# EAGLE design FMC_intan_RHD_interface (EAGLE 6.3)
DESIGNER: OPEN EPHYS; DESIGN_NAME: FMC ACQUISITION ADAPTER; REVISION: 0.1

## Sheet 1 of 2
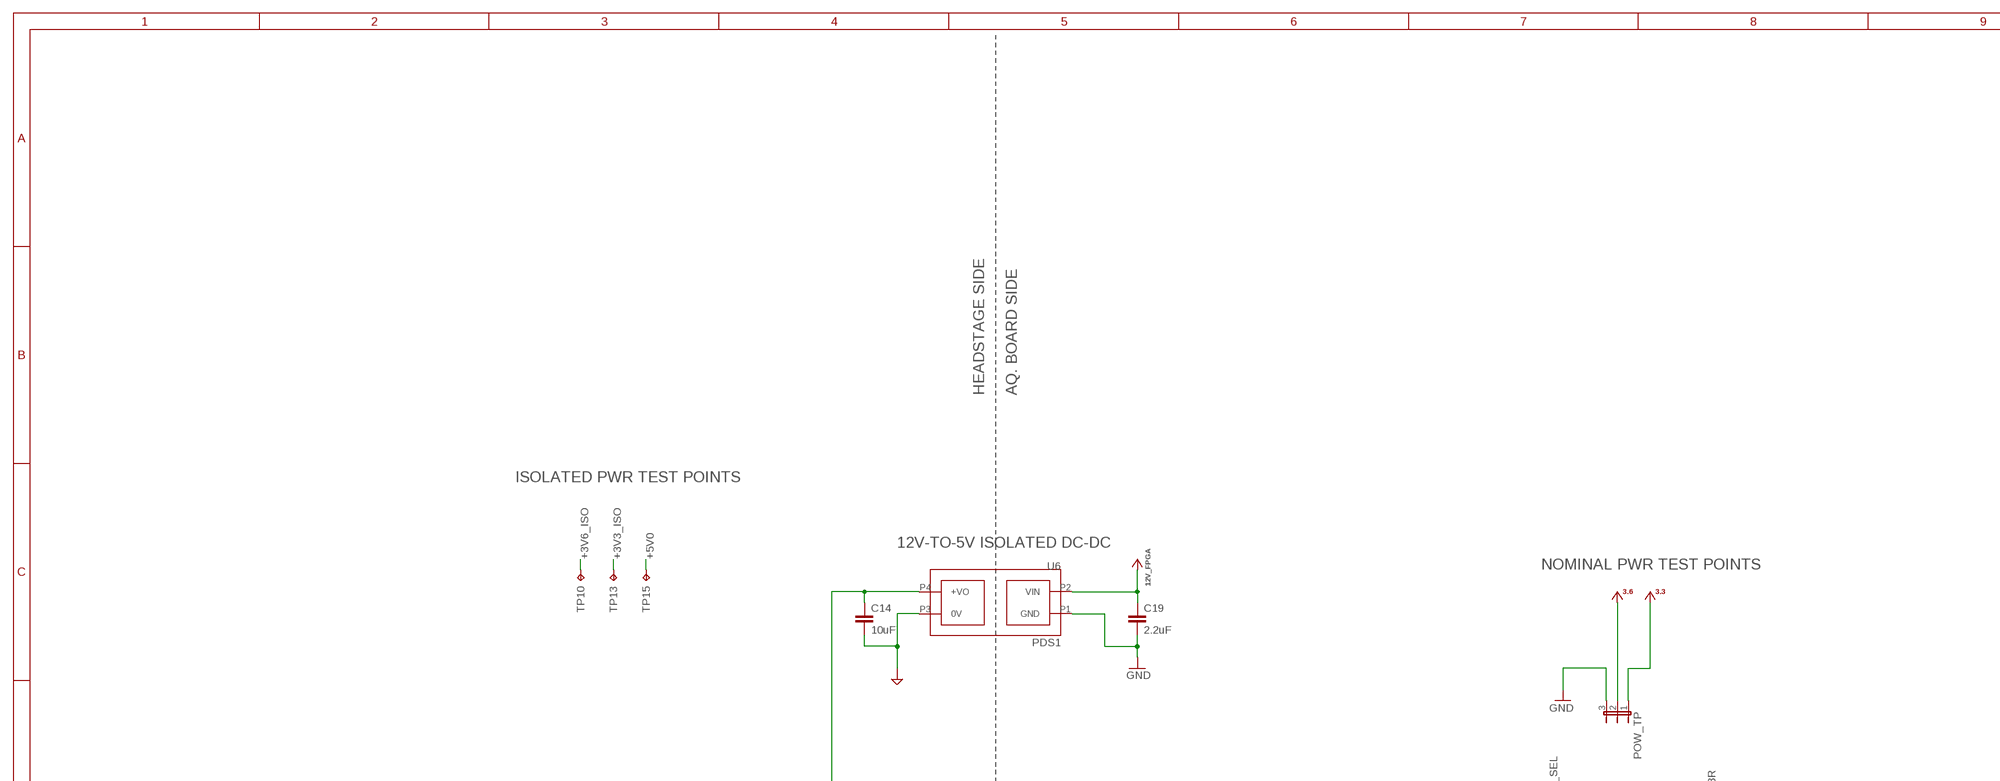
[diagram p0: schematic, sheet 1, part 1 of 3]
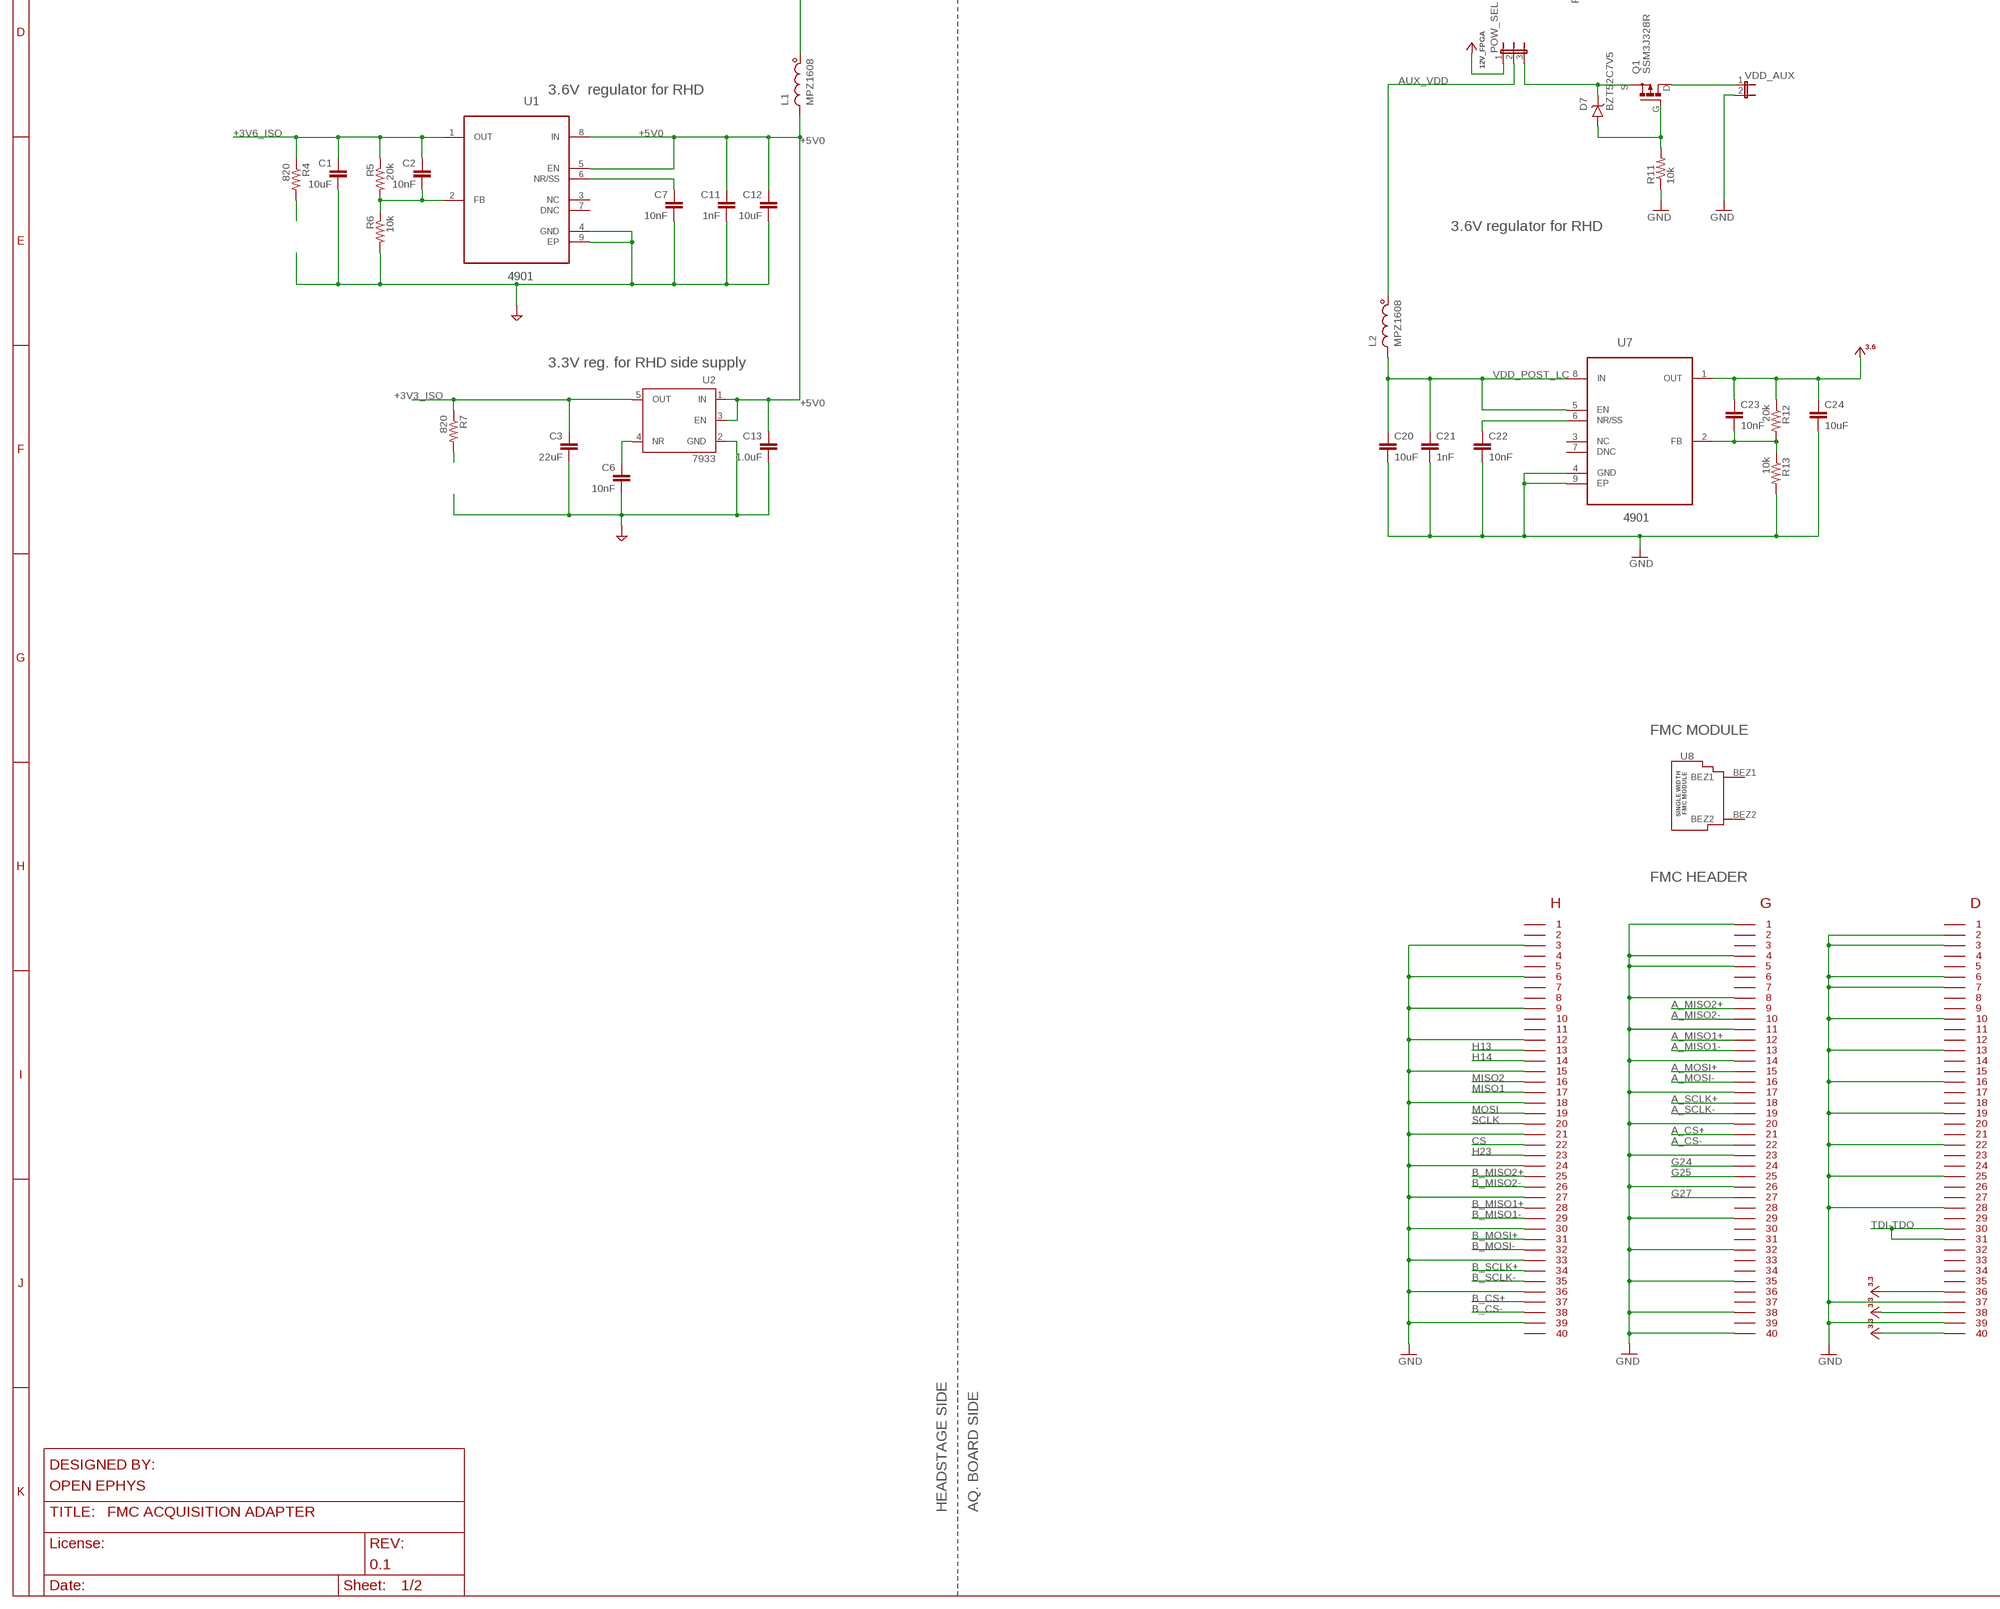
[diagram p1: schematic, sheet 1, part 2 of 3]
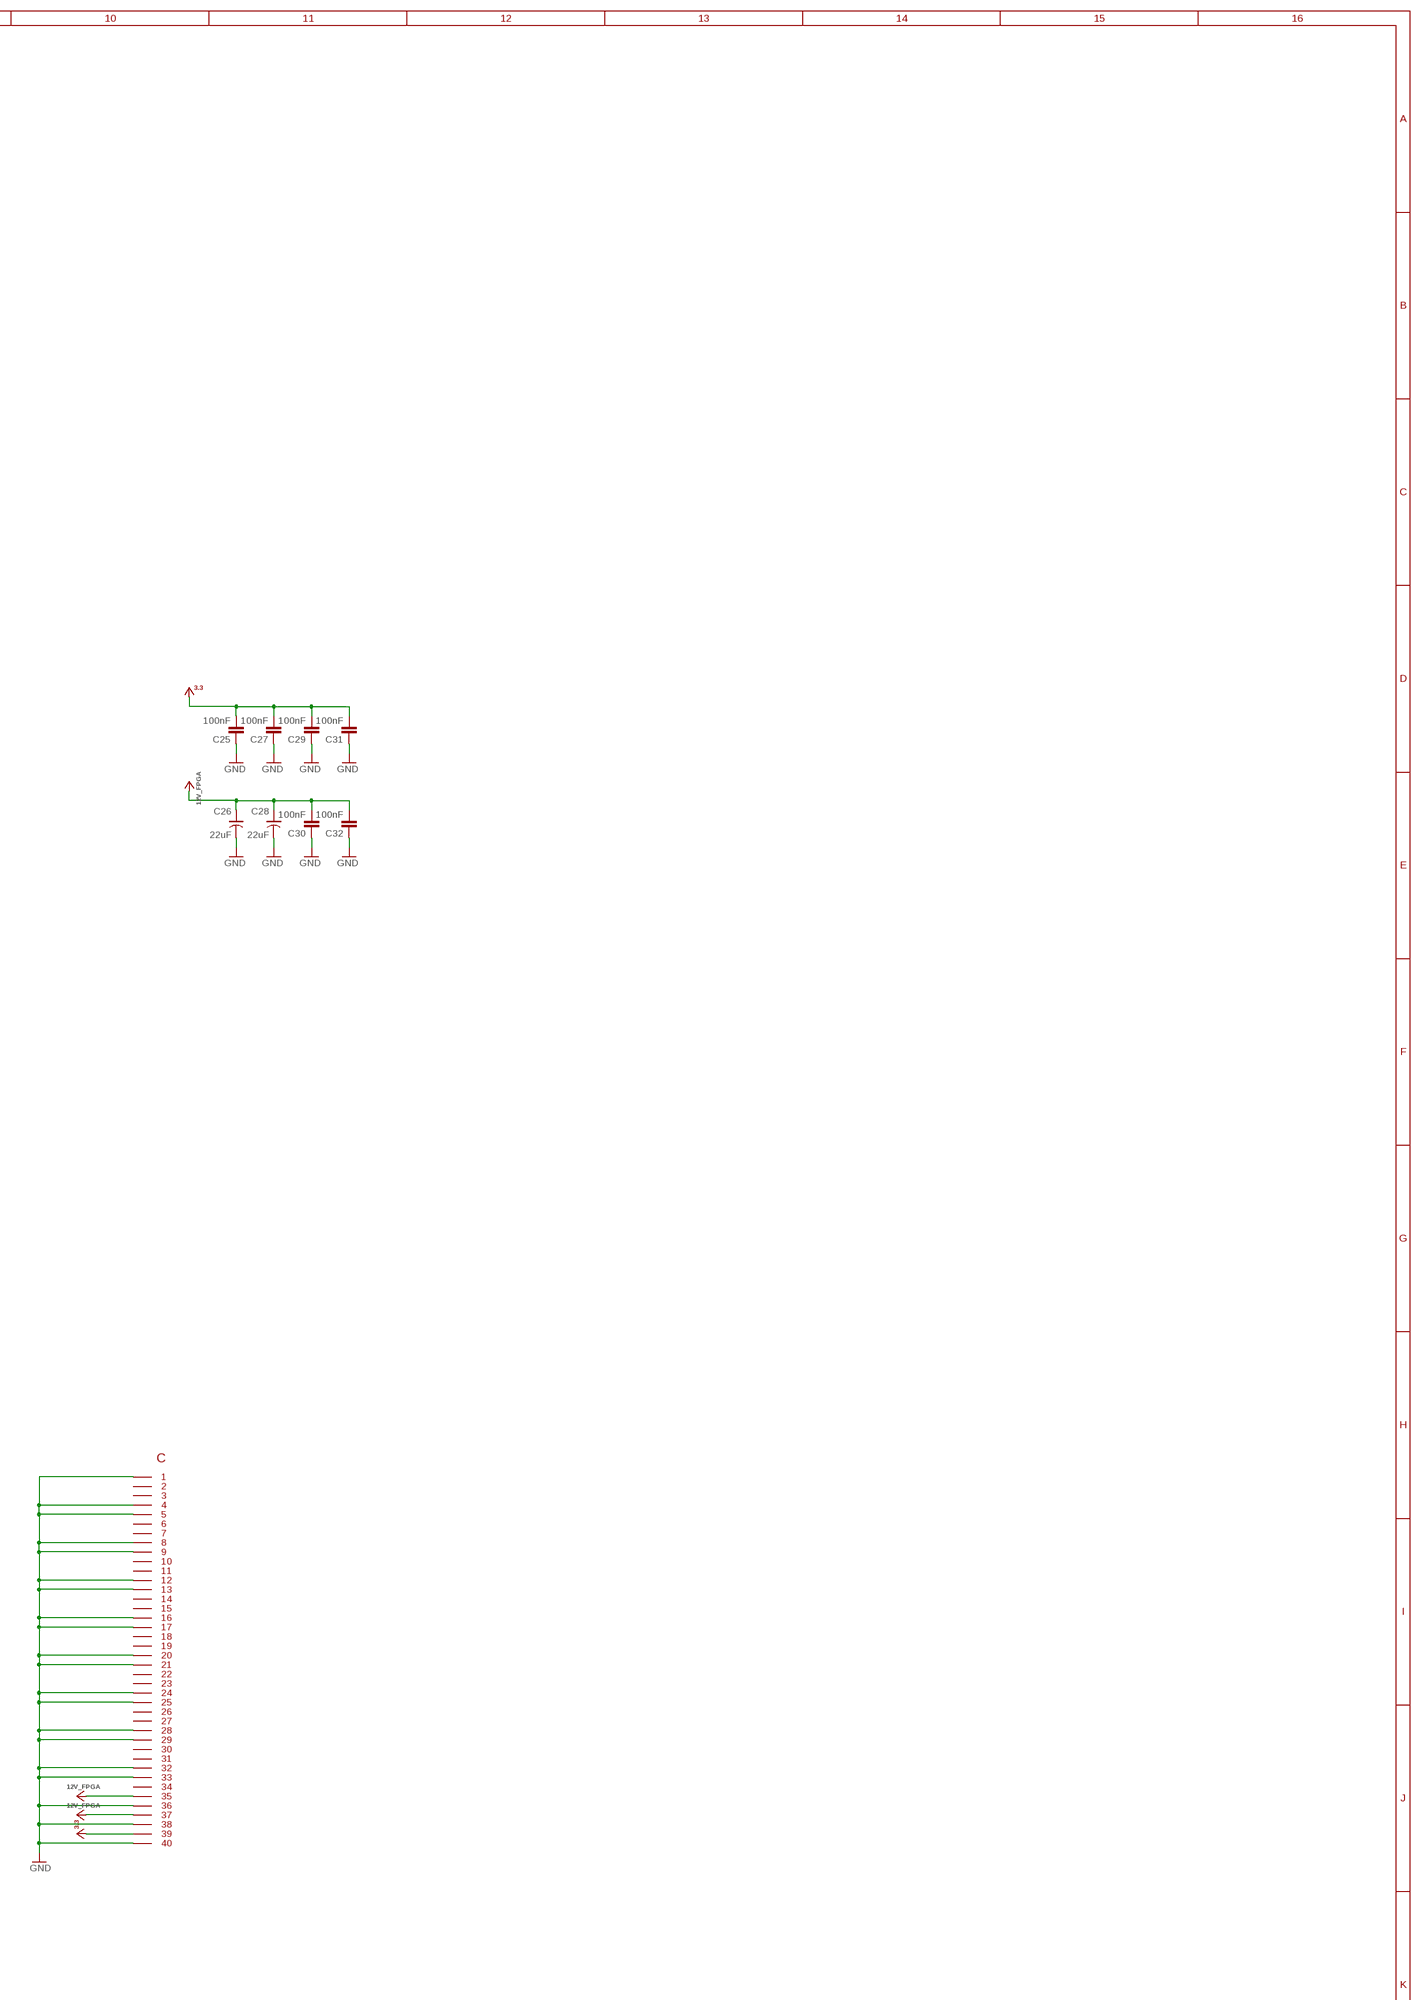
[diagram p2: schematic, sheet 1, part 3 of 3]

### Parts
C1  10uF  C_1206  [1206]
C2  10nF  C_0603  [0603]
C3  22uF  C_1206  [1206]
C6  10nF  C_0603  [0603]
C7  10nF  C_0603  [0603]
C11  1nF  C_0603  [0603]
C12  10uF  C_1206  [1206]
C13  1.0uF  C_0805  [0805]
C14  10uF  C_1206  [1206]
C19  2.2uF  C_1206  [1206]
C20  10uF  C_1206  [1206]
C21  1nF  C_0603  [0603]
C22  10nF  C_0603  [0603]
C23  10nF  C_0603  [0603]
C24  10uF  C_1206  [1206]
C25  100nF  C_0603  [0603]
C26  22uF  C-POL_1210  [1210-POL]
C27  100nF  C_0603  [0603]
C28  22uF  C-POL_1210  [1210-POL]
C29  100nF  C_0603  [0603]
C30  100nF  C_0603  [0603]
C31  100nF  C_0603  [0603]
C32  100nF  C_0603  [0603]
D7  BZT52C7V5  Z-DIODE_SOD123  [SOD123]
FMC  FMC_LPC_160_PIN  [FMC_LPC_MALE_WITH_SP601_BSILK]
L1  MPZ1608  L_0603  [0603]
L2  MPZ1608  L_0603  [0603]
POW_SEL  JP3E  [JP3]
POW_TP  JP3E  [JP3]
Q1  SSM3J328R  P-MOSFET_SOT23-GSD  [SOT23-GSD]
R4  820  R_0603  [0603]
R5  20k  R_0603  [0603]
R6  10k  R_0603  [0603]
R7  820  R_0603  [0603]
R11  10k  R_0603  [0603]
R12  20k  R_0603  [0603]
R13  10k  R_0603  [0603]
TP10  +3V6  TPTP06R  [TP06R]
TP13  +3V3  TPTP06R  [TP06R]
TP15  +5V0  TPTP06R  [TP06R]
U1  4901  TPS7A4901DGNR  [SOP65P490X110-9N]
U2  7933  TPS79333  [SOT-23-5]
U6  PDS1  [PDS1]
U7  4901  TPS7A4901DGNR  [SOP65P490X110-9N]
U8  FMC_SINGLE_WIDTH_MODULE  [FMC_SINGLE_WIDTH_MODULE]
VDD_AUX  JP2E_THRU-HOLE  [JP2]

### Nets
12V_FPGA: C19.1 C26.+ C28.+ C30.2 C32.2 FMC.P$155 FMC.P$157 POW_SEL.1 U6.P2(VIN)
+3V3: C25.2 C27.2 C29.2 C31.2 FMC.P$116 FMC.P$118 FMC.P$120 FMC.P$159 POW_TP.1 ; also sheet 2
+3V3_ISO: C3.1 R7.1 TP13.TP U2.5(OUT) ; also sheet 2
+3V6: C23.1 C24.1 POW_TP.2 R12.1 U7.1(OUT)
+3V6_ISO: C1.1 C2.1 R4.1 R5.1 TP10.TP U1.1(OUT) ; also sheet 2
+5V0: C11.1 C12.1 C13.1 L1.2 TP15.TP U1.5(EN) U1.8(IN) U2.1(IN) U2.3(EN)
+5V0_ISO-PRE: C14.1 L1.1 U6.P4(+VO)
A_CS+: FMC.P$61
A_CS-: FMC.P$62
A_MISO1+: FMC.P$52
A_MISO1-: FMC.P$53
A_MISO2+: FMC.P$49
A_MISO2-: FMC.P$50
A_MOSI+: FMC.P$55
A_MOSI-: FMC.P$56
A_SCLK+: FMC.P$58
A_SCLK-: FMC.P$59
AGND1: C23.2 R12.2 R13.1 U7.2(FB)
AGND2: C2.2 R5.2 R6.1 U1.2(FB)
AUX_VDD: L2.1 POW_SEL.2
B_CS+: FMC.P$37
B_CS-: FMC.P$38
B_MISO1+: FMC.P$28
B_MISO1-: FMC.P$29
B_MISO2+: FMC.P$25
B_MISO2-: FMC.P$26
B_MOSI+: FMC.P$31
B_MOSI-: FMC.P$32
B_SCLK+: FMC.P$34
B_SCLK-: FMC.P$35
CS: FMC.P$22 ; also sheet 2
G24: FMC.P$64
G25: FMC.P$65
G27: FMC.P$67
GND: C19.2 C20.2 C21.2 C22.2 C24.2 C25.1 C26.- C27.1 C28.- C29.1 C30.1 C31.1 C32.1 FMC.P$3 FMC.P$6 FMC.P$9 FMC.P$12 FMC.P$15 FMC.P$18 FMC.P$21 FMC.P$24 FMC.P$27 FMC.P$30 FMC.P$33 FMC.P$36 FMC.P$39 FMC.P$41 FMC.P$44 FMC.P$45 FMC.P$48 FMC.P$51 FMC.P$54 FMC.P$57 FMC.P$60 FMC.P$63 FMC.P$66 FMC.P$69 FMC.P$72 FMC.P$75 FMC.P$78 FMC.P$80 FMC.P$82 FMC.P$83 FMC.P$86 FMC.P$87 FMC.P$90 FMC.P$93 FMC.P$96 FMC.P$99 FMC.P$102 FMC.P$105 FMC.P$108 FMC.P$117 FMC.P$119 FMC.P$121 FMC.P$124 FMC.P$125 FMC.P$128 FMC.P$129 FMC.P$132 FMC.P$133 FMC.P$136 FMC.P$137 FMC.P$140 FMC.P$141 FMC.P$144 FMC.P$145 FMC.P$148 FMC.P$149 FMC.P$152 FMC.P$153 FMC.P$156 FMC.P$158 FMC.P$160 POW_TP.3 R11.1 R13.2 U6.P1(GND) U7.4(GND) U7.9(EP) VDD_AUX.2 ; also sheet 2
GND_ISO: C1.2 C3.2 C6.2 C7.2 C11.2 C12.2 C13.2 C14.2 R6.2 U1.4(GND) U1.9(EP) U2.2(GND) U6.P3(0V) ; also sheet 2
H13: FMC.P$13 ; also sheet 2
H14: FMC.P$14 ; also sheet 2
H23: FMC.P$23 ; also sheet 2
MISO1: FMC.P$17 ; also sheet 2
MISO2: FMC.P$16 ; also sheet 2
MOSI: FMC.P$19 ; also sheet 2
N$1: C22.1 U7.6(NR/SS)
N$3: D7.C POW_SEL.3 Q1.S
N$4: C7.1 U1.6(NR/SS)
N$6: D7.A Q1.G R11.2
N$7: Q1.D VDD_AUX.1
N$8: R4.2
N$10: R7.2
N$97: C6.1 U2.4(NR)
SCLK: FMC.P$20 ; also sheet 2
TDI-TDO: FMC.P$110 FMC.P$111
VDD_POST_LC: C20.1 C21.1 L2.2 U7.5(EN) U7.8(IN)
Unconnected: FMC.P$1 FMC.P$2 FMC.P$4 FMC.P$5 FMC.P$7 FMC.P$8 FMC.P$10 FMC.P$11 FMC.P$40 FMC.P$42 FMC.P$43 FMC.P$46 FMC.P$47 FMC.P$68 FMC.P$70 FMC.P$71 FMC.P$73 FMC.P$74 FMC.P$76 FMC.P$77 FMC.P$79 FMC.P$81 FMC.P$84 FMC.P$85 FMC.P$88 FMC.P$89 FMC.P$91 FMC.P$92 FMC.P$94 FMC.P$95 FMC.P$97 FMC.P$98 FMC.P$100 FMC.P$101 FMC.P$103 FMC.P$104 FMC.P$106 FMC.P$107 FMC.P$109 FMC.P$112 FMC.P$113 FMC.P$114 FMC.P$115 FMC.P$122 FMC.P$123 FMC.P$126 FMC.P$127 FMC.P$130 FMC.P$131 FMC.P$134 FMC.P$135 FMC.P$138 FMC.P$139 FMC.P$142 FMC.P$143 FMC.P$146 FMC.P$147 FMC.P$150 FMC.P$151 FMC.P$154 U1.3(NC) U1.7(DNC) U7.3(NC) U7.7(DNC) U8.BEZ1 U8.BEZ2

### Notes on the sheet
- HEADSTAGE SIDE | AQ. BOARD SIDE
- ISOLATED PWR TEST POINTS
- 12V-TO-5V ISOLATED DC-DC
- NOMINAL PWR TEST POINTS
- 3.6V  regulator for RHD
- 3.6V regulator for RHD
- 3.3V reg. for RHD side supply
- FMC MODULE
- FMC HEADER
- HEADSTAGE SIDE | AQ. BOARD SIDE

## Sheet 2 of 2
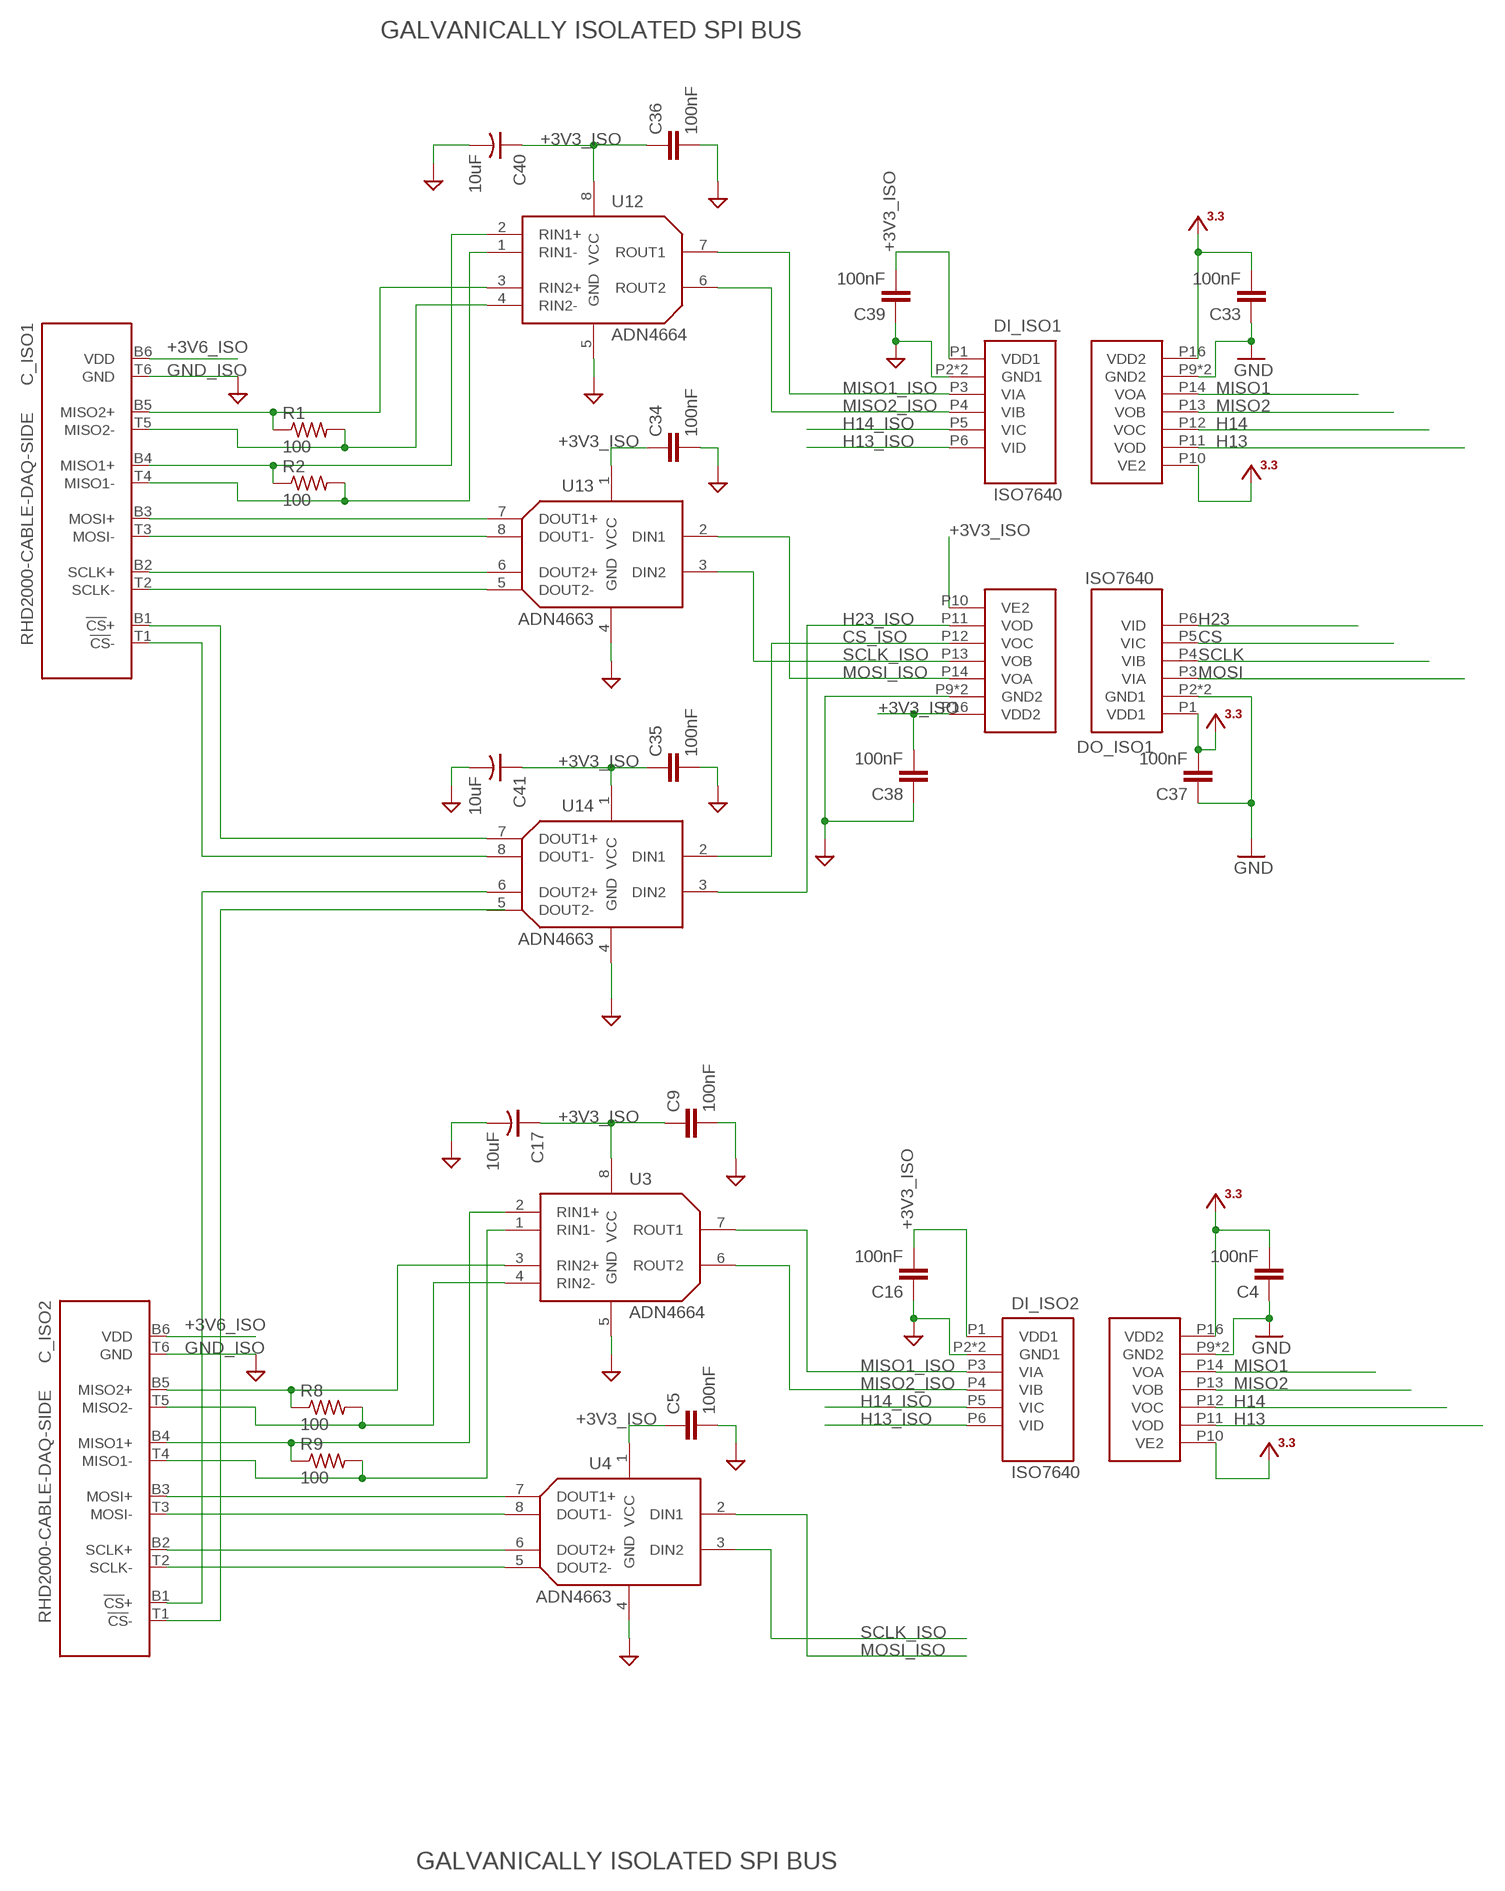
[diagram p3: schematic, sheet 2, part 1 of 2]
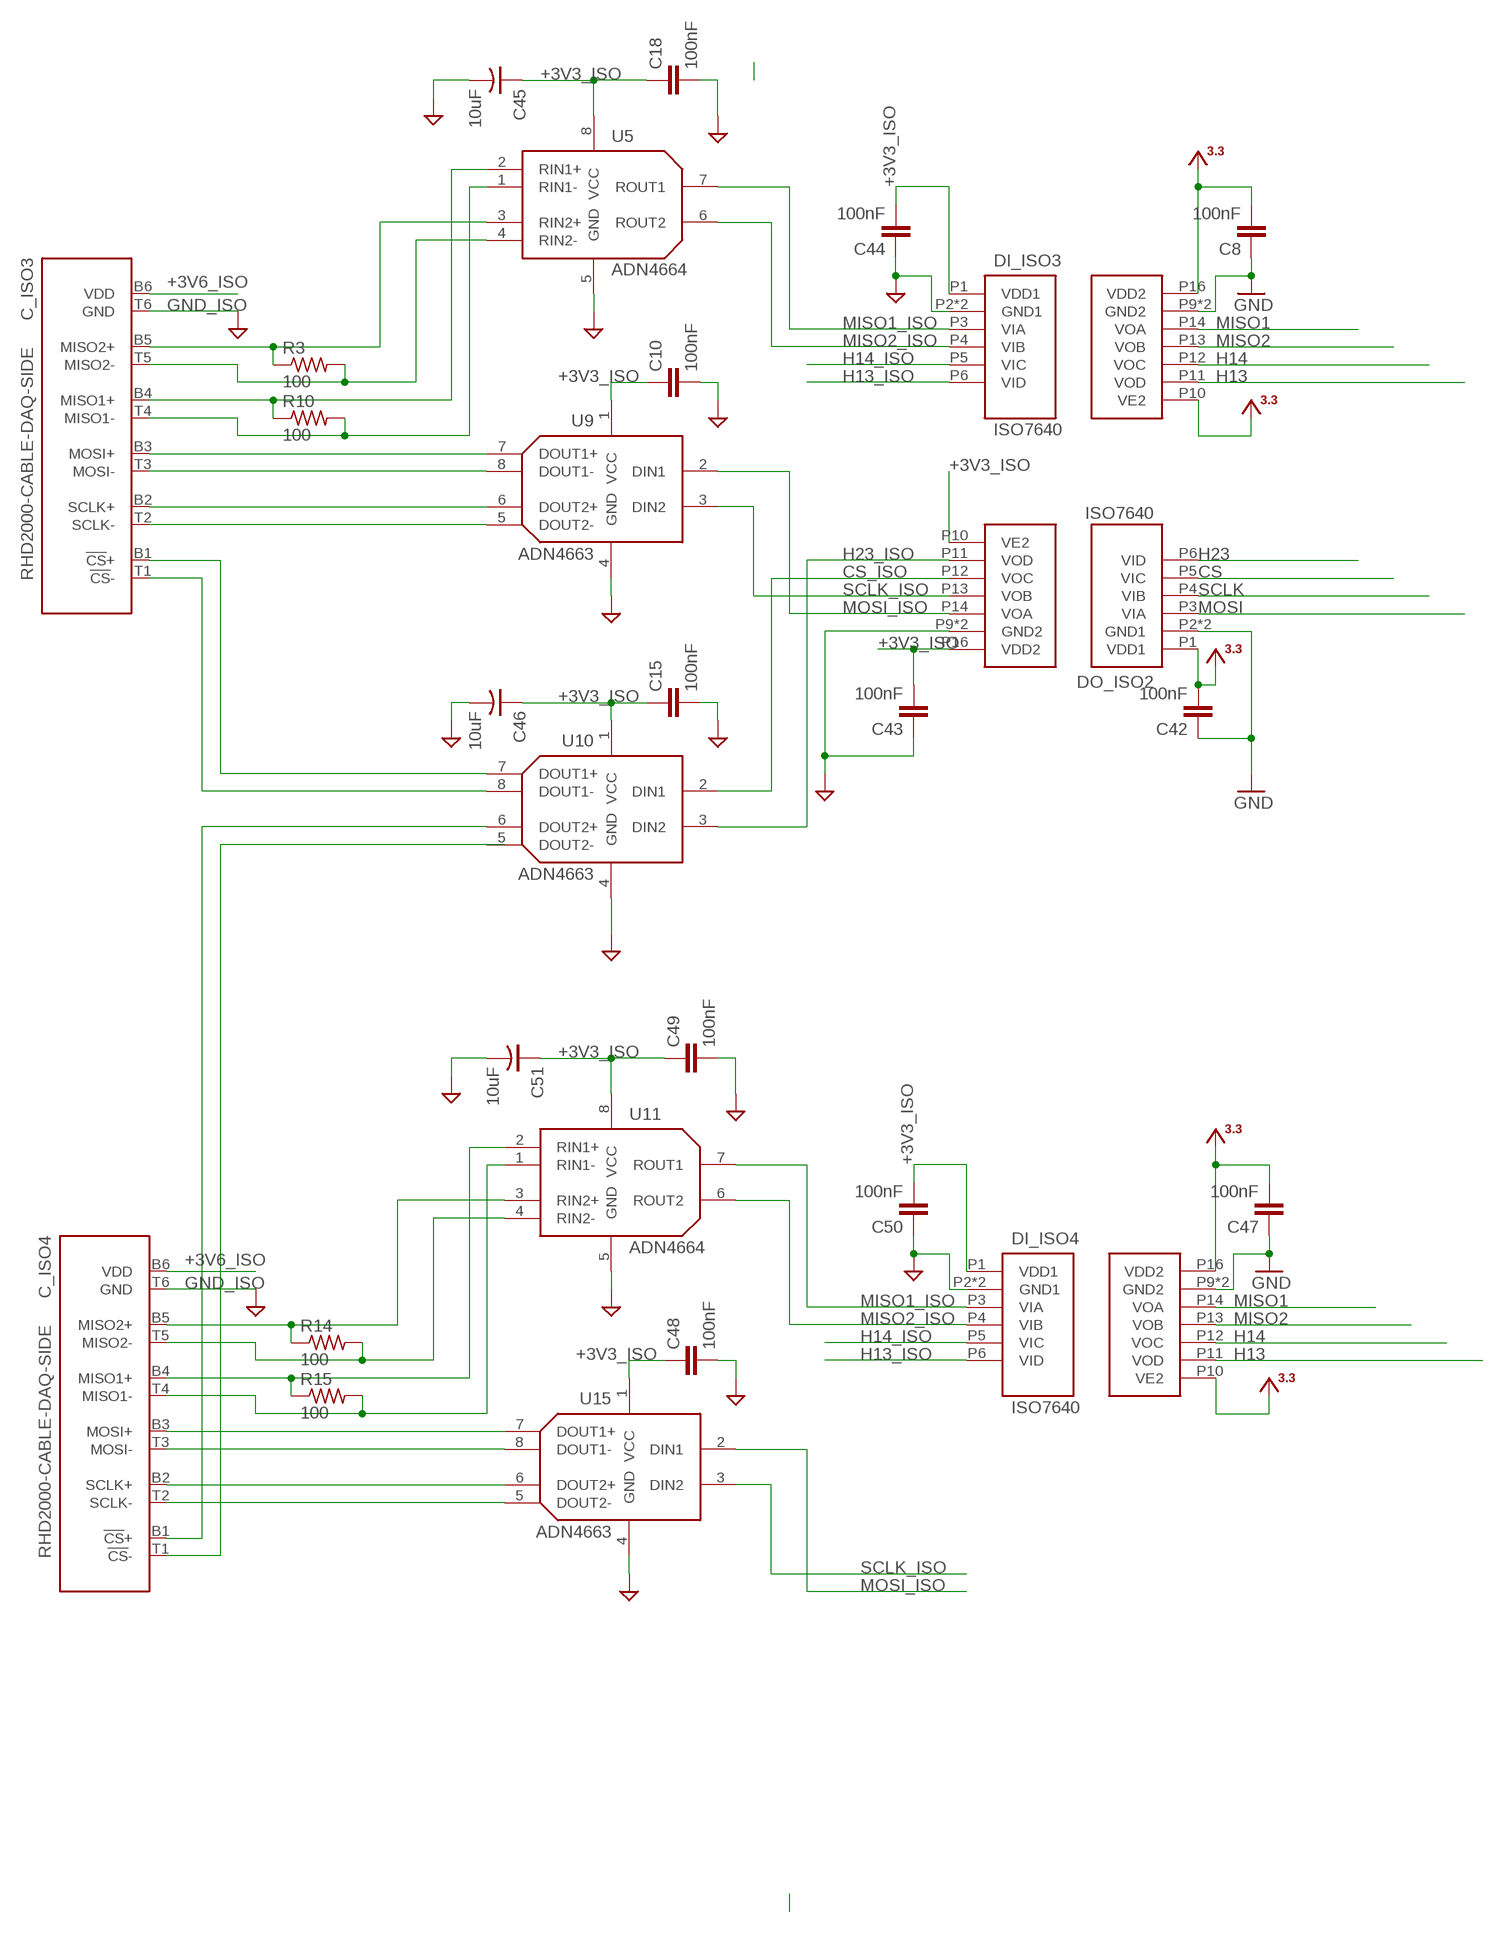
[diagram p4: schematic, sheet 2, part 2 of 2]

### Parts
C4  100nF  C_0603  [0603]
C5  100nF  C_0603  [0603]
C8  100nF  C_0603  [0603]
C9  100nF  C_0603  [0603]
C10  100nF  C_0603  [0603]
C15  100nF  C_0603  [0603]
C16  100nF  C_0603  [0603]
C17  10uF  C-POL_1206  [1206-POL]
C18  100nF  C_0603  [0603]
C33  100nF  C_0603  [0603]
C34  100nF  C_0603  [0603]
C35  100nF  C_0603  [0603]
C36  100nF  C_0603  [0603]
C37  100nF  C_0603  [0603]
C38  100nF  C_0603  [0603]
C39  100nF  C_0603  [0603]
C40  10uF  C-POL_1206  [1206-POL]
C41  10uF  C-POL_1206  [1206-POL]
C42  100nF  C_0603  [0603]
C43  100nF  C_0603  [0603]
C44  100nF  C_0603  [0603]
C45  10uF  C-POL_1206  [1206-POL]
C46  10uF  C-POL_1206  [1206-POL]
C47  100nF  C_0603  [0603]
C48  100nF  C_0603  [0603]
C49  100nF  C_0603  [0603]
C50  100nF  C_0603  [0603]
C51  10uF  C-POL_1206  [1206-POL]
C_ISO1  RHD2000-CABLE-DAQ-SIDE  [OMNETICS_PZN-12-AA]
C_ISO2  RHD2000-CABLE-DAQ-SIDE  [OMNETICS_PZN-12-AA]
C_ISO3  RHD2000-CABLE-DAQ-SIDE  [OMNETICS_PZN-12-AA]
C_ISO4  RHD2000-CABLE-DAQ-SIDE  [OMNETICS_PZN-12-AA]
DI_ISO1  ISO7640  ADUM3440  [SOIC_WIDE_16]
DI_ISO2  ISO7640  ADUM3440  [SOIC_WIDE_16]
DI_ISO3  ISO7640  ADUM3440  [SOIC_WIDE_16]
DI_ISO4  ISO7640  ADUM3440  [SOIC_WIDE_16]
DO_ISO1  ISO7640  ADUM3440  [SOIC_WIDE_16]
DO_ISO2  ISO7640  ADUM3440  [SOIC_WIDE_16]
R1  100  R_0603  [0603]
R2  100  R_0603  [0603]
R3  100  R_0603  [0603]
R8  100  R_0603  [0603]
R9  100  R_0603  [0603]
R10  100  R_0603  [0603]
R14  100  R_0603  [0603]
R15  100  R_0603  [0603]
U3  ADN4664  ADN4664_SOIC  [SOIC127P500X400-8N]
U4  ADN4663  ADN4663_SOIC  [SOIC127P500X400-8N]
U5  ADN4664  ADN4664_SOIC  [SOIC127P500X400-8N]
U9  ADN4663  ADN4663_SOIC  [SOIC127P500X400-8N]
U10  ADN4663  ADN4663_SOIC  [SOIC127P500X400-8N]
U11  ADN4664  ADN4664_SOIC  [SOIC127P500X400-8N]
U12  ADN4664  ADN4664_SOIC  [SOIC127P500X400-8N]
U13  ADN4663  ADN4663_SOIC  [SOIC127P500X400-8N]
U14  ADN4663  ADN4663_SOIC  [SOIC127P500X400-8N]
U15  ADN4663  ADN4663_SOIC  [SOIC127P500X400-8N]

### Nets
+3V3: C4.2 C8.2 C33.2 C37.2 C42.2 C47.2 DI_ISO1.P10(VE2) DI_ISO1.P16(VDD2) DI_ISO2.P10(VE2) DI_ISO2.P16(VDD2) DI_ISO3.P10(VE2) DI_ISO3.P16(VDD2) DI_ISO4.P10(VE2) DI_ISO4.P16(VDD2) DO_ISO1.P1(VDD1) DO_ISO2.P1(VDD1) ; also sheet 1
+3V3_ISO: C5.1 C9.1 C10.1 C15.1 C16.2 C17.+ C18.1 C34.1 C35.1 C36.1 C38.2 C39.2 C40.+ C41.+ C43.2 C44.2 C45.+ C46.+ C48.1 C49.1 C50.2 C51.+ DI_ISO1.P1(VDD1) DI_ISO2.P1(VDD1) DI_ISO3.P1(VDD1) DI_ISO4.P1(VDD1) DO_ISO1.P10(VE2) DO_ISO1.P16(VDD2) DO_ISO2.P10(VE2) DO_ISO2.P16(VDD2) U3.8(VCC) U4.1(VCC) U5.8(VCC) U9.1(VCC) U10.1(VCC) U11.8(VCC) U12.8(VCC) U13.1(VCC) U14.1(VCC) U15.1(VCC) ; also sheet 1
+3V6_ISO: C_ISO1.B6(VDD) C_ISO2.B6(VDD) C_ISO3.B6(VDD) C_ISO4.B6(VDD) ; also sheet 1
CS: DO_ISO1.P5(VIC) DO_ISO2.P5(VIC) ; also sheet 1
CS+_ISOLATED1: C_ISO1.B1(!CS!+) U14.7(DOUT1+)
CS+_ISOLATED2: C_ISO2.B1(!CS!+)
CS+_ISOLATED3: C_ISO3.B1(!CS!+) U10.7(DOUT1+)
CS+_ISOLATED4: C_ISO4.B1(!CS!+)
CS-_ISOLATED1: C_ISO1.T1(!CS!-) U14.8(DOUT1-)
CS-_ISOLATED2: C_ISO2.T1(!CS!-)
CS-_ISOLATED3: C_ISO3.T1(!CS!-) U10.8(DOUT1-)
CS-_ISOLATED4: C_ISO4.T1(!CS!-)
CS_ISO: DO_ISO1.P12(VOC) DO_ISO2.P12(VOC) U10.2(DIN1) U14.2(DIN1)
GND: C4.1 C8.1 C33.1 C37.1 C42.1 C47.1 DI_ISO1.P9(GND2) DI_ISO1.P15(GND2) DI_ISO2.P9(GND2) DI_ISO2.P15(GND2) DI_ISO3.P9(GND2) DI_ISO3.P15(GND2) DI_ISO4.P9(GND2) DI_ISO4.P15(GND2) DO_ISO1.P2(GND1) DO_ISO1.P8(GND1) DO_ISO2.P2(GND1) DO_ISO2.P8(GND1) ; also sheet 1
GND_ISO: C5.2 C9.2 C10.2 C15.2 C16.1 C17.- C18.2 C34.2 C35.2 C36.2 C38.1 C39.1 C40.- C41.- C43.1 C44.1 C45.- C46.- C48.2 C49.2 C50.1 C51.- C_ISO1.T6(GND) C_ISO2.T6(GND) C_ISO3.T6(GND) C_ISO4.T6(GND) DI_ISO1.P2(GND1) DI_ISO1.P8(GND1) DI_ISO2.P2(GND1) DI_ISO2.P8(GND1) DI_ISO3.P2(GND1) DI_ISO3.P8(GND1) DI_ISO4.P2(GND1) DI_ISO4.P8(GND1) DO_ISO1.P9(GND2) DO_ISO1.P15(GND2) DO_ISO2.P9(GND2) DO_ISO2.P15(GND2) U3.5(GND) U4.4(GND) U5.5(GND) U9.4(GND) U10.4(GND) U11.5(GND) U12.5(GND) U13.4(GND) U14.4(GND) U15.4(GND) ; also sheet 1
H13: DI_ISO1.P11(VOD) DI_ISO2.P11(VOD) DI_ISO3.P11(VOD) DI_ISO4.P11(VOD) ; also sheet 1
H13_ISO: DI_ISO1.P6(VID) DI_ISO2.P6(VID) DI_ISO3.P6(VID) DI_ISO4.P6(VID)
H14: DI_ISO1.P12(VOC) DI_ISO2.P12(VOC) DI_ISO3.P12(VOC) DI_ISO4.P12(VOC) ; also sheet 1
H14_ISO: DI_ISO1.P5(VIC) DI_ISO2.P5(VIC) DI_ISO3.P5(VIC) DI_ISO4.P5(VIC)
H23: DO_ISO1.P6(VID) DO_ISO2.P6(VID) ; also sheet 1
H23_ISO: DO_ISO1.P11(VOD) DO_ISO2.P11(VOD) U10.3(DIN2) U14.3(DIN2)
MISO1: DI_ISO1.P14(VOA) DI_ISO2.P14(VOA) DI_ISO3.P14(VOA) DI_ISO4.P14(VOA) ; also sheet 1
MISO1+_ISOLATED1: C_ISO1.B4(MISO1+) R2.1 U12.2(RIN1+)
MISO1+_ISOLATED2: C_ISO2.B4(MISO1+) R9.1 U3.2(RIN1+)
MISO1+_ISOLATED3: C_ISO3.B4(MISO1+) R10.1 U5.2(RIN1+)
MISO1+_ISOLATED4: C_ISO4.B4(MISO1+) R15.1 U11.2(RIN1+)
MISO1-_ISOLATED1: C_ISO1.T4(MISO1-) R2.2 U12.1(RIN1-)
MISO1-_ISOLATED2: C_ISO2.T4(MISO1-) R9.2 U3.1(RIN1-)
MISO1-_ISOLATED3: C_ISO3.T4(MISO1-) R10.2 U5.1(RIN1-)
MISO1-_ISOLATED4: C_ISO4.T4(MISO1-) R15.2 U11.1(RIN1-)
MISO1_ISO: DI_ISO1.P3(VIA) DI_ISO2.P3(VIA) DI_ISO3.P3(VIA) DI_ISO4.P3(VIA) U3.7(ROUT1) U5.7(ROUT1) U11.7(ROUT1) U12.7(ROUT1)
MISO2: DI_ISO1.P13(VOB) DI_ISO2.P13(VOB) DI_ISO3.P13(VOB) DI_ISO4.P13(VOB) ; also sheet 1
MISO2+_ISOLATED1: C_ISO1.B5(MISO2+) R1.1 U12.3(RIN2+)
MISO2+_ISOLATED2: C_ISO2.B5(MISO2+) R8.1 U3.3(RIN2+)
MISO2+_ISOLATED3: C_ISO3.B5(MISO2+) R3.1 U5.3(RIN2+)
MISO2+_ISOLATED4: C_ISO4.B5(MISO2+) R14.1 U11.3(RIN2+)
MISO2-_ISOLATED1: C_ISO1.T5(MISO2-) R1.2 U12.4(RIN2-)
MISO2-_ISOLATED2: C_ISO2.T5(MISO2-) R8.2 U3.4(RIN2-)
MISO2-_ISOLATED3: C_ISO3.T5(MISO2-) R3.2 U5.4(RIN2-)
MISO2-_ISOLATED4: C_ISO4.T5(MISO2-) R14.2 U11.4(RIN2-)
MISO2_ISO: DI_ISO1.P4(VIB) DI_ISO2.P4(VIB) DI_ISO3.P4(VIB) DI_ISO4.P4(VIB) U3.6(ROUT2) U5.6(ROUT2) U11.6(ROUT2) U12.6(ROUT2)
MOSI: DO_ISO1.P3(VIA) DO_ISO2.P3(VIA) ; also sheet 1
MOSI_ISO: DO_ISO1.P14(VOA) DO_ISO2.P14(VOA) U4.2(DIN1) U9.2(DIN1) U13.2(DIN1) U15.2(DIN1)
N$2: C_ISO3.B3(MOSI+) U9.7(DOUT1+)
N$9: C_ISO1.B3(MOSI+) U13.7(DOUT1+)
N$11: C_ISO1.T3(MOSI-) U13.8(DOUT1-)
N$12: C_ISO2.B3(MOSI+) U4.7(DOUT1+)
N$13: C_ISO2.T3(MOSI-) U4.8(DOUT1-)
N$14: C_ISO1.B2(SCLK+) U13.6(DOUT2+)
N$15: C_ISO2.B2(SCLK+) U4.6(DOUT2+)
N$16: C_ISO2.T2(SCLK-) U4.5(DOUT2-)
N$17: C_ISO1.T2(SCLK-) U13.5(DOUT2-)
N$18: C_ISO3.T3(MOSI-) U9.8(DOUT1-)
N$19: C_ISO3.B2(SCLK+) U9.6(DOUT2+)
N$20: C_ISO3.T2(SCLK-) U9.5(DOUT2-)
N$21: C_ISO4.B3(MOSI+) U15.7(DOUT1+)
N$22: C_ISO4.T3(MOSI-) U15.8(DOUT1-)
N$23: C_ISO4.B2(SCLK+) U15.6(DOUT2+)
N$24: C_ISO4.T2(SCLK-) U15.5(DOUT2-)
SCLK: DO_ISO1.P4(VIB) DO_ISO2.P4(VIB) ; also sheet 1
SCLK_ISO: DO_ISO1.P13(VOB) DO_ISO2.P13(VOB) U4.3(DIN2) U9.3(DIN2) U13.3(DIN2) U15.3(DIN2)
Unconnected: U10.5(DOUT2-) U10.6(DOUT2+) U14.5(DOUT2-) U14.6(DOUT2+)

### Notes on the sheet
- GALVANICALLY ISOLATED SPI BUS
- GALVANICALLY ISOLATED SPI BUS

## Power pins joined to a net without a drawn wire
GND: FMC.GNDA(GND$1:GND) FMC.GNDB(GND$2:GND)

## Library data of the parts
C1 C12 C20 C24 = puggleboard:C: Capacitor
C2 C7 C11 C14 C19 C21-C23 = jonnew:C: Capacitor
C3-C6 C8-C10 C13 C15 C16 C18 C25 C27 C29-C39 C42-C44 C47-C50 = RHD2000_eval_board:C: Capacitor
C17 C26 C28 C40 C41 C45 C46 C51 = jonnew:C-POL: Polarized Capacitor
C_ISO1-C_ISO4 = RHD2000_eval_board:RHD2000-CABLE-DAQ-SIDE: Omnetics PZN-12-AA RHD2000 socket - DAQ side
D7 = jonnew:Z-DIODE: Zener Diode
DI_ISO1-DI_ISO4 DO_ISO1 DO_ISO2 = jonnew:ADUM3440
FMC = jonnew:FMC_LPC_160_PIN
L1 L2 = jonnew:L: Inductor
POW_SEL POW_TP = jonnew:JP3E
Q1 = jonnew:P-MOSFET
R1-R4 R7-R10 R14 R15 = RHD2000_eval_board:R: Resistor
R5 R6 R11-R13 = jonnew:R: Resistor; DK: PxxxxHTR-ND; MN: Panasonic; MPN: ERJ-3EKFxxxxV
TP10 TP13 TP15 = jonnew:TP: Test pad
U1 U7 = jonnew:TPS7A4901DGNR: ?36V, ?200mA, Ultralow-Noise, Negative LINEAR REGULATOR; MPN: TPS7A4901DGNR; OC_FARNELL: -; OC_NEWARK: 01T0879; PACKAGE: MSOP-8; SUPPLIER: Texas Instruments
U2 = jonnew:TPS79333: Texas Instruments TPS79333 3.3V LDO regulator
U3 U5 U11 U12 = jonnew:ADN4664: Dual LVLDS to 3V3 CMOS differential line receiver
U4 U9 U10 U13-U15 = jonnew:ADN4663: Dual 3V3 CMOS to LVDS differential line driver
U6 = jonnew:PDS1: CUI inc. DC-DC converter, see http://www.cui.com/product/resource/pds1-s.pdf
U8 = jonnew:FMC_SINGLE_WIDTH_MODULE
VDD_AUX = jonnew:JP2E

## Board
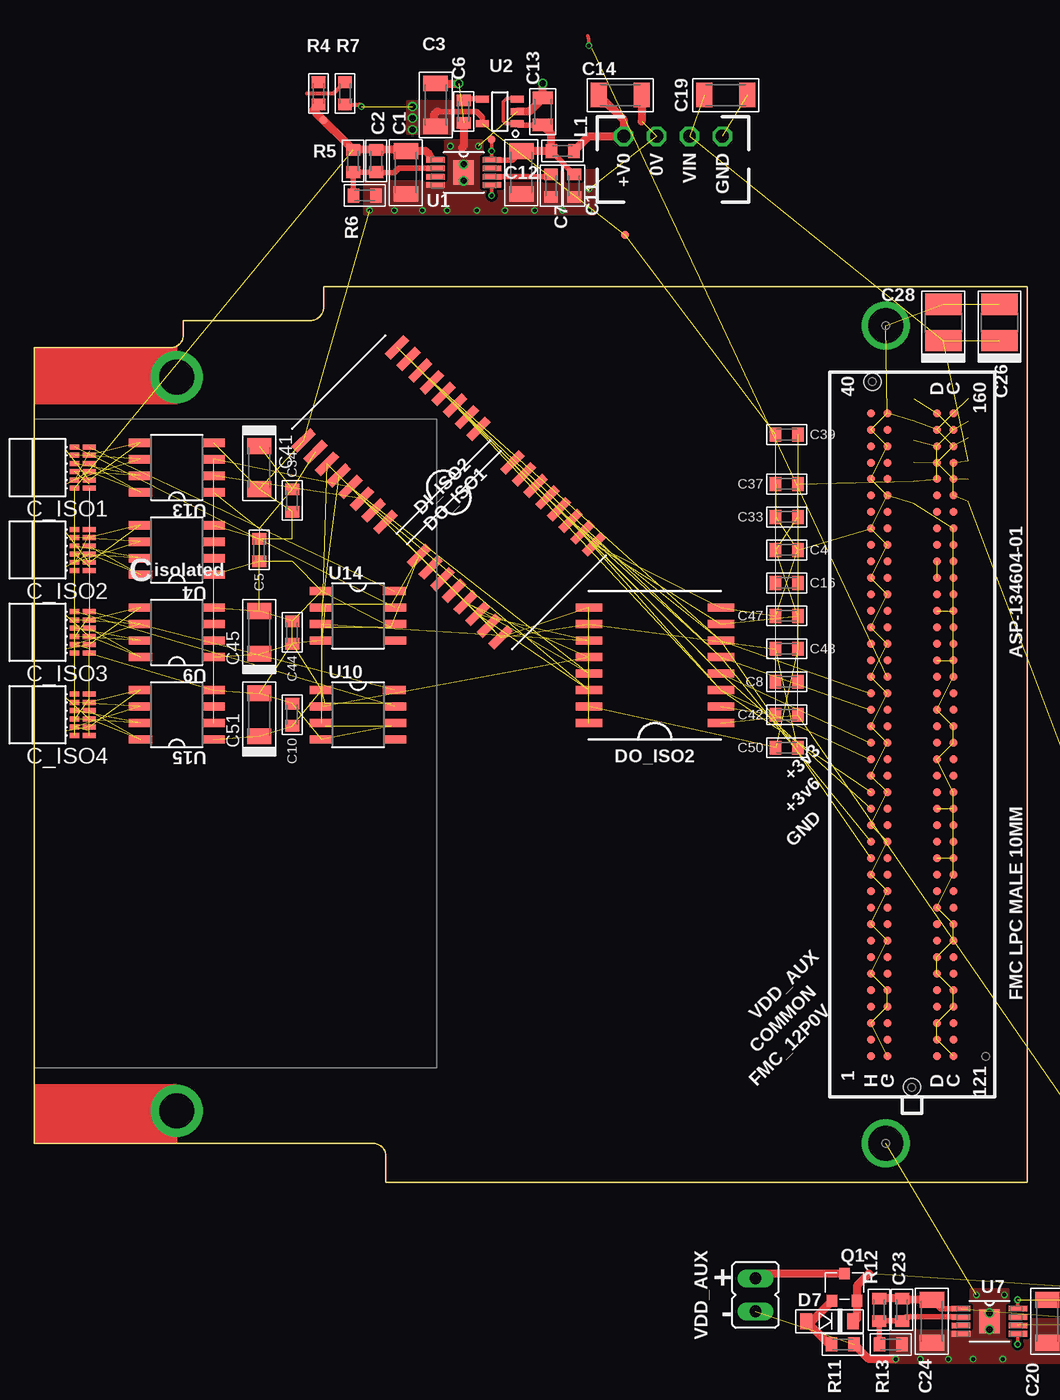
[diagram p5: board, top side]
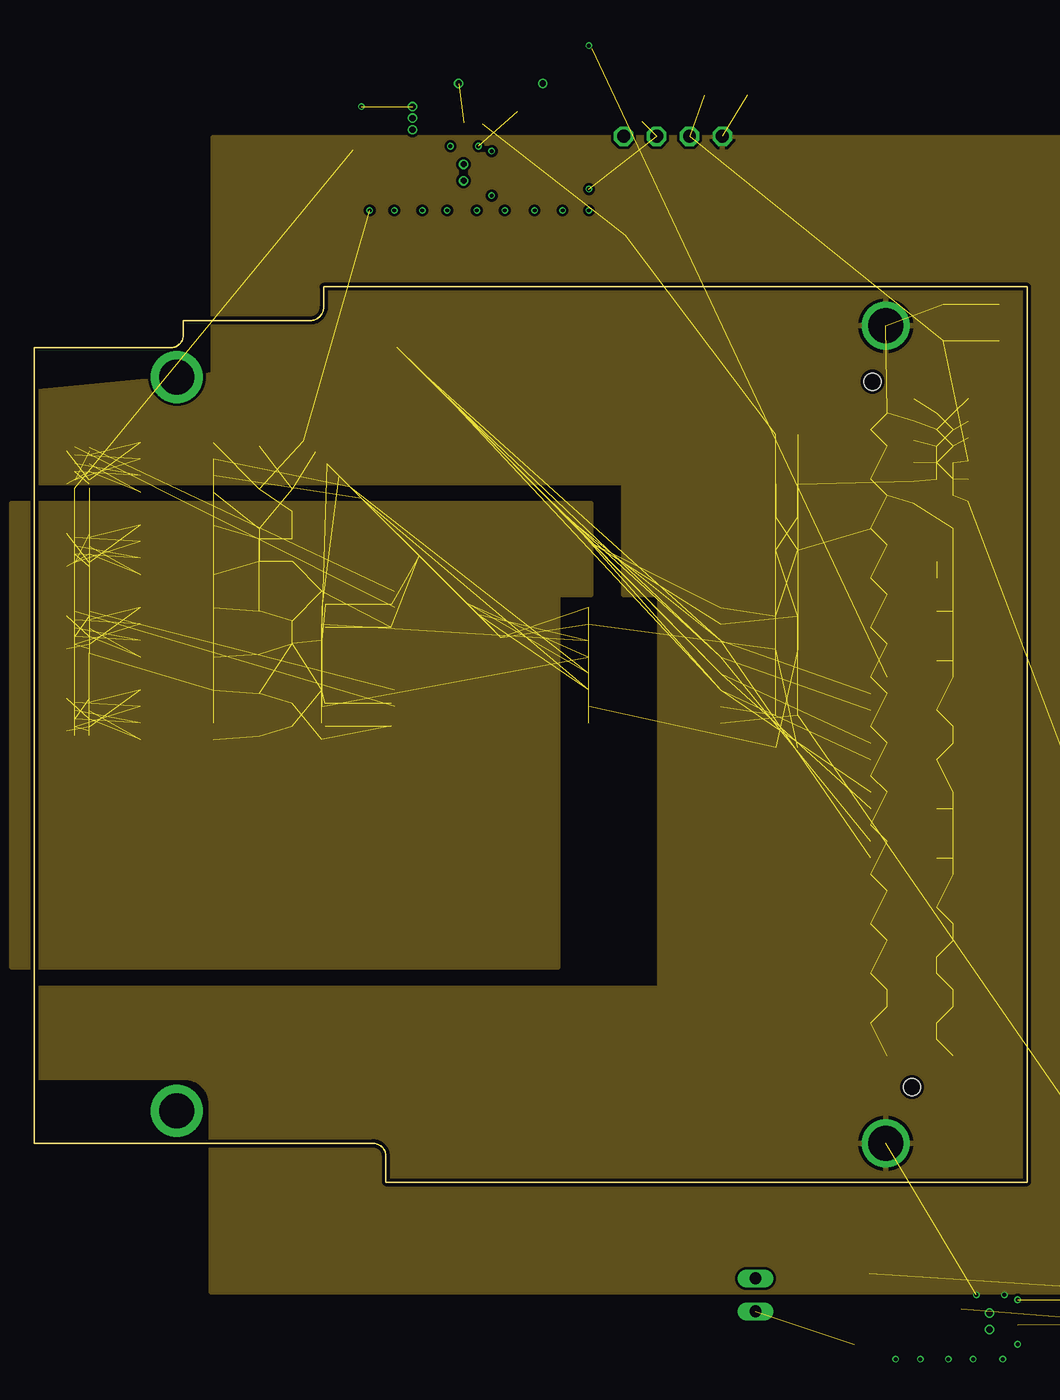
[diagram p6: board, inner layer $GND]
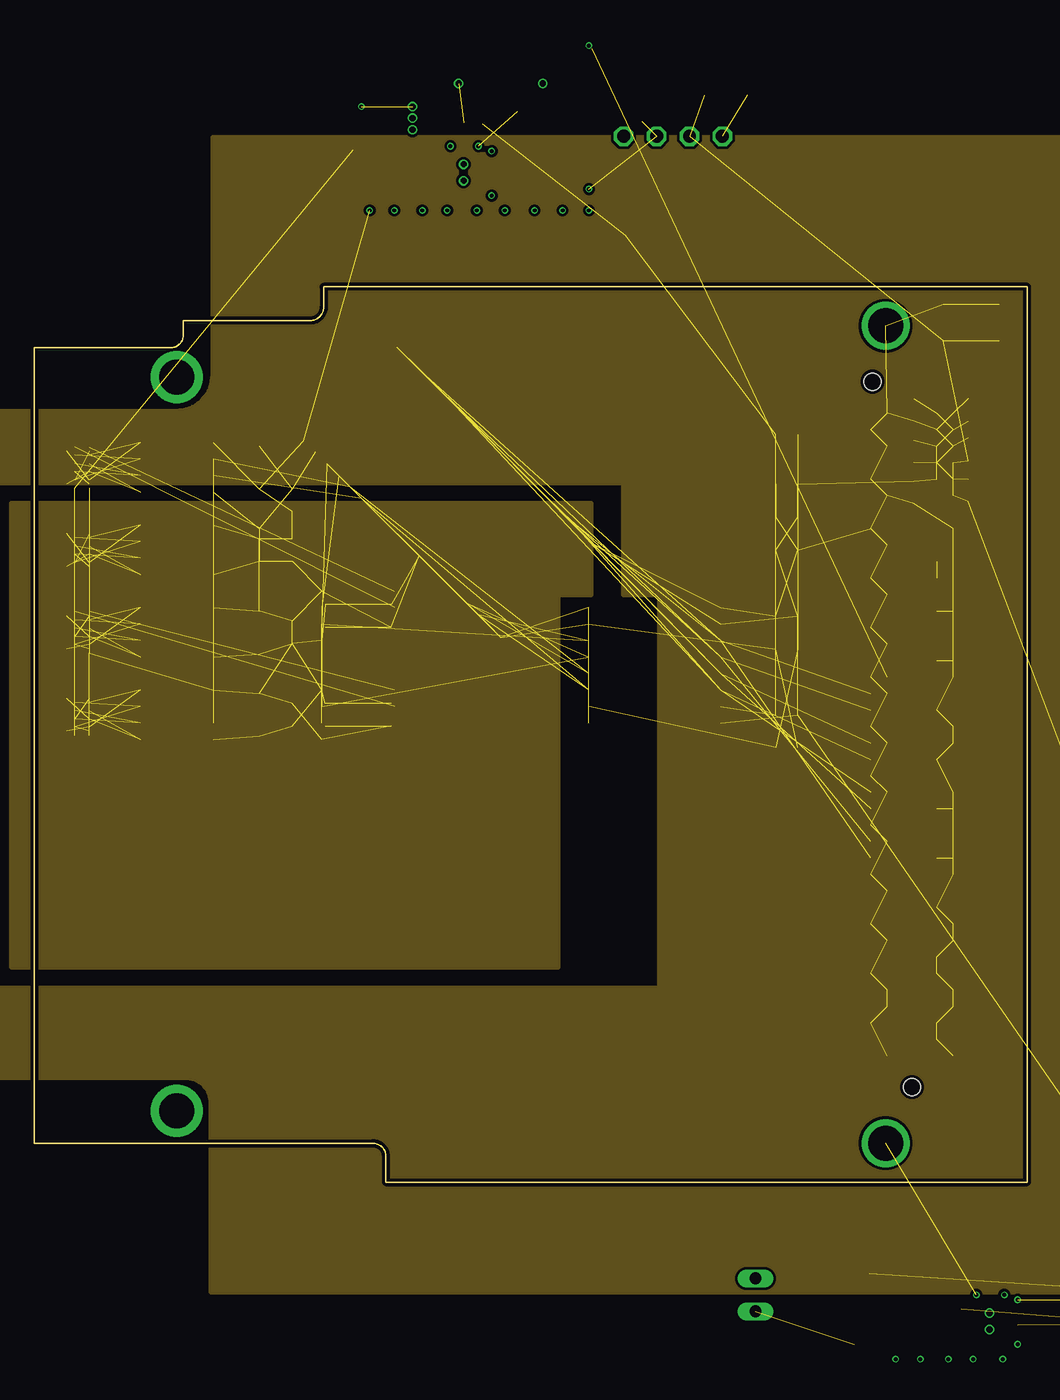
[diagram p7: board, inner layer $VCC]
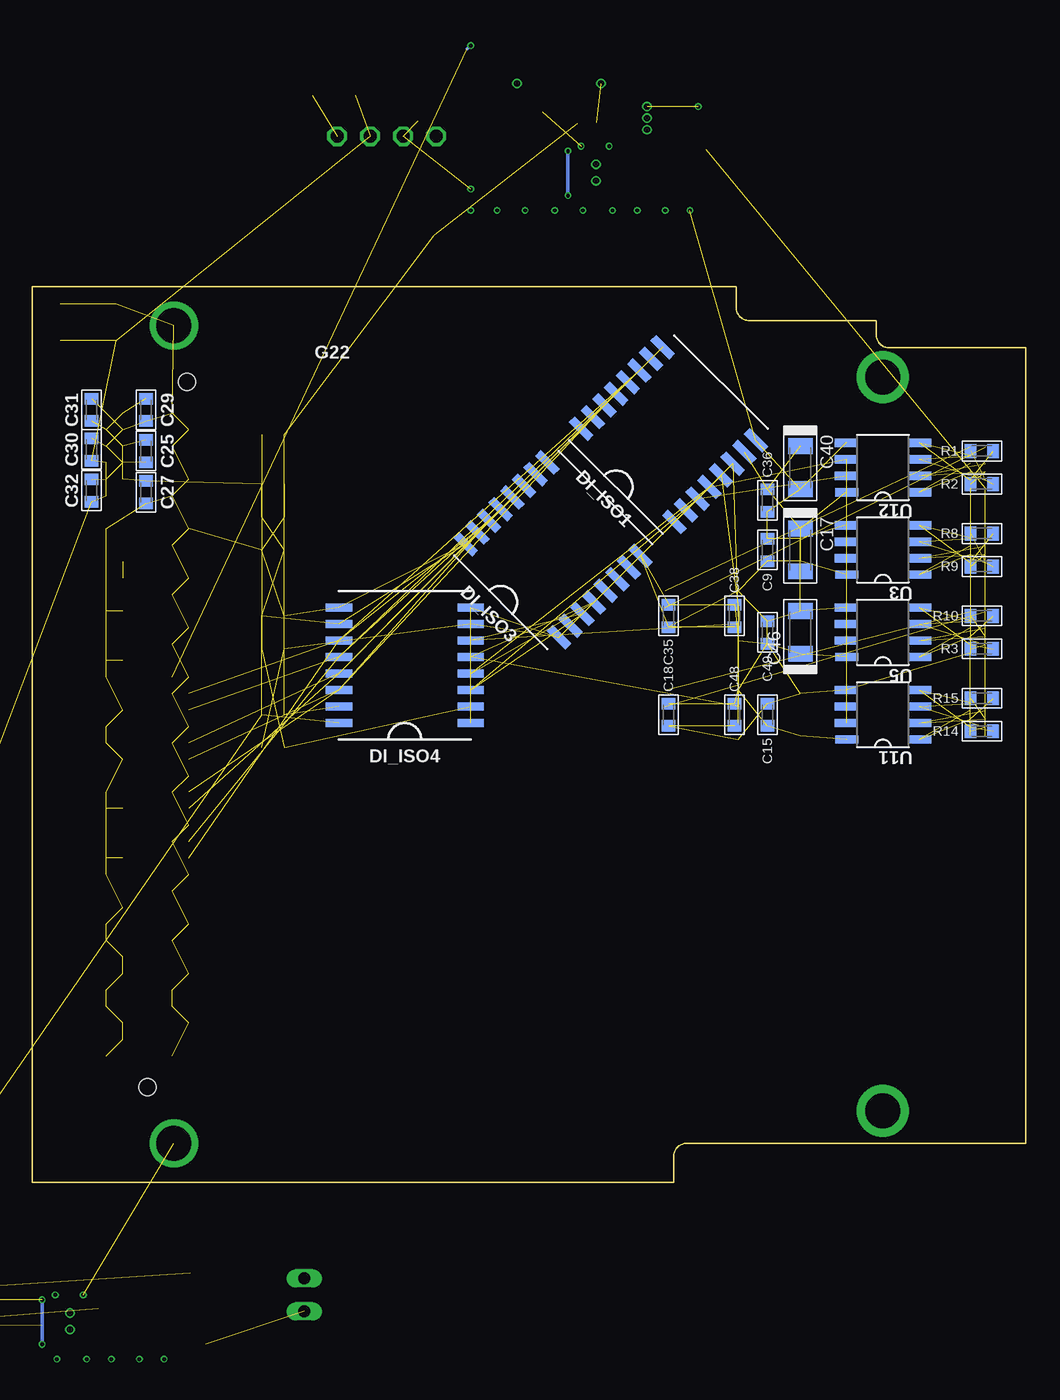
[diagram p8: board, bottom side, seen from below]

Size 76.5 x 69 mm. Coordinates in mm from the lower left corner, seen from the top.
Copper layers (1*2*15*16): Top 0.035mm / dielectric 0.2mm / $GND 0.0175mm / dielectric 0.3mm / $VCC 0.0175mm / dielectric 0.2mm / Bottom 0.035mm
Design rules "seeed-studio-4-layer": minimum track width 8mil, minimum drill 12mil, track to track 8mil, track to pad 8mil, pad to pad 8mil, via to via 8mil, smd to smd 0mil, copper to edge 10mil, drill to drill 8mil, minimum pad ring 6mil, minimum via ring 4mil, stop-mask expansion 4mil, vias tented up to drill 100mil, thermal gap 10mil

### Footprints (pad centres in the part's own frame; a part is rotated, then mirrored left to right if it is on the bottom)
1206 = smd 1.219 x 1.88: 1 -1.651,0; 2 1.651,0
0603 = smd 0.889 x 1.067: 1 -0.864,0; 2 0.864,0
0805 = smd 0.965 x 1.524: 1 -1.041,0; 2 1.041,0
1206-POL = smd 1.219 x 1.88: + -1.651,0; - 1.651,0
1210-POL = smd 1.651 x 2.794: + -1.397,0; - 1.397,0
OMNETICS_PZN-12-AA = smd 0.381 x 0.762: B1 1.587,-1.016; B2 0.953,-1.016; B3 0.318,-1.016; B4 -0.318,-1.016; B5 -0.953,-1.016; B6 -1.587,-1.016 | smd 0.381 x 1.016: T1 1.587,-2.159; T2 0.953,-2.159; T3 0.318,-2.159; T4 -0.318,-2.159; T5 -0.953,-2.159; T6 -1.587,-2.159
SOD123 = smd 0.914 x 1.219: A -1.8,0; C 1.8,0
SOIC_WIDE_16 = smd 0.635 x 2.032: P1 -4.445,-5.08; P2 -3.175,-5.08; P3 -1.905,-5.08; P4 -0.635,-5.08; P5 0.635,-5.08; P6 1.905,-5.08; P7 3.175,-5.08; P8 4.445,-5.08; P9 4.445,5.08; P10 3.175,5.08; P11 1.905,5.08; P12 0.635,5.08; P13 -0.635,5.08; P14 -1.905,5.08; P15 -3.175,5.08; P16 -4.445,5.08
FMC_LPC_MALE_WITH_SP601_BSILK = drill 2.692: GNDA -31.496,2.032; GNDB 31.496,2.032 | smd 0.635 x 0.635 bottom: P$1 24.765,3.175; P$2 23.495,3.175; P$3 22.225,3.175; P$4 20.955,3.175; P$5 19.685,3.175; P$6 18.415,3.175; P$7 17.145,3.175; P$8 15.875,3.175; P$9 14.605,3.175; P$10 13.335,3.175; P$11 12.065,3.175; P$12 10.795,3.175; P$13 9.525,3.175; P$14 8.255,3.175; P$15 6.985,3.175; P$16 5.715,3.175; P$17 4.445,3.175; P$18 3.175,3.175; P$19 1.905,3.175; P$20 0.635,3.175; P$21 -0.635,3.175; P$22 -1.905,3.175; P$23 -3.175,3.175; P$24 -4.445,3.175; P$25 -5.715,3.175; P$26 -6.985,3.175; P$27 -8.255,3.175; P$28 -9.525,3.175; P$29 -10.795,3.175; P$30 -12.065,3.175; P$31 -13.335,3.175; P$32 -14.605,3.175; P$33 -15.875,3.175; P$34 -17.145,3.175; P$35 -18.415,3.175; P$36 -19.685,3.175; P$37 -20.955,3.175; P$38 -22.225,3.175; P$39 -23.495,3.175; P$40 -24.765,3.175; P$41 24.765,1.905; P$42 23.495,1.905; P$43 22.225,1.905; P$44 20.955,1.905; P$45 19.685,1.905; P$46 18.415,1.905; P$47 17.145,1.905; P$48 15.875,1.905; P$49 14.605,1.905; P$50 13.335,1.905; P$51 12.065,1.905; P$52 10.795,1.905; P$53 9.525,1.905; P$54 8.255,1.905; P$55 6.985,1.905; P$56 5.715,1.905; P$57 4.445,1.905; P$58 3.175,1.905; P$59 1.905,1.905; P$60 0.635,1.905; P$61 -0.635,1.905; P$62 -1.905,1.905; P$63 -3.175,1.905; P$64 -4.445,1.905; P$65 -5.715,1.905; P$66 -6.985,1.905; P$67 -8.255,1.905; P$68 -9.525,1.905; P$69 -10.795,1.905; P$70 -12.065,1.905; P$71 -13.335,1.905; P$72 -14.605,1.905; P$73 -15.875,1.905; P$74 -17.145,1.905; P$75 -18.415,1.905; P$76 -19.685,1.905; P$77 -20.955,1.905; P$78 -22.225,1.905; P$79 -23.495,1.905; P$80 -24.765,1.905; P$81 24.765,-1.905; P$82 23.495,-1.905; P$83 22.225,-1.905; P$84 20.955,-1.905; P$85 19.685,-1.905; P$86 18.415,-1.905; P$87 17.145,-1.905; P$88 15.875,-1.905; P$89 14.605,-1.905; P$90 13.335,-1.905; P$91 12.065,-1.905; P$92 10.795,-1.905; P$93 9.525,-1.905; P$94 8.255,-1.905; P$95 6.985,-1.905; P$96 5.715,-1.905; P$97 4.445,-1.905; P$98 3.175,-1.905; P$99 1.905,-1.905; P$100 0.635,-1.905; P$101 -0.635,-1.905; P$102 -1.905,-1.905; P$103 -3.175,-1.905; P$104 -4.445,-1.905; P$105 -5.715,-1.905; P$106 -6.985,-1.905; P$107 -8.255,-1.905; P$108 -9.525,-1.905; P$109 -10.795,-1.905; P$110 -12.065,-1.905; P$111 -13.335,-1.905; P$112 -14.605,-1.905; P$113 -15.875,-1.905; P$114 -17.145,-1.905; P$115 -18.415,-1.905; P$116 -19.685,-1.905; P$117 -20.955,-1.905; P$118 -22.225,-1.905; P$119 -23.495,-1.905; P$120 -24.765,-1.905; P$121 24.765,-3.175; P$122 23.495,-3.175; P$123 22.225,-3.175; P$124 20.955,-3.175; P$125 19.685,-3.175; P$126 18.415,-3.175; P$127 17.145,-3.175; P$128 15.875,-3.175; P$129 14.605,-3.175; P$130 13.335,-3.175; P$131 12.065,-3.175; P$132 10.795,-3.175; P$133 9.525,-3.175; P$134 8.255,-3.175; P$135 6.985,-3.175; P$136 5.715,-3.175; P$137 4.445,-3.175; P$138 3.175,-3.175; P$139 1.905,-3.175; P$140 0.635,-3.175; P$141 -0.635,-3.175; P$142 -1.905,-3.175; P$143 -3.175,-3.175; P$144 -4.445,-3.175; P$145 -5.715,-3.175; P$146 -6.985,-3.175; P$147 -8.255,-3.175; P$148 -9.525,-3.175; P$149 -10.795,-3.175; P$150 -12.065,-3.175; P$151 -13.335,-3.175; P$152 -14.605,-3.175; P$153 -15.875,-3.175; P$154 -17.145,-3.175; P$155 -18.415,-3.175; P$156 -19.685,-3.175; P$157 -20.955,-3.175; P$158 -22.225,-3.175; P$159 -23.495,-3.175; P$160 -24.765,-3.175 | hole 1.321: 27.165,0; -27.191,3.048
JP3 = drill 0.914 long: 1 0,0; 2 2.54,0; 3 5.08,0
SOT23-GSD = smd 0.8 x 0.9: D 0,0; G -0.95,-2.1; S 0.95,-2.1
TP06R = smd 0.6 x 0.6: TP 0,0
SOP65P490X110-9N = smd 1.422 x 0.432: 1 -2.184,0.965; 2 -2.184,0.33; 3 -2.184,-0.33; 4 -2.184,-0.965; 5 2.184,-0.965; 6 2.184,-0.33; 7 2.184,0.33; 8 2.184,0.965 | smd 1.575 x 1.88: 9 0,0
SOT-23-5 = smd 0.55 x 1: 1 -0.95,-1.35; 2 0,-1.35; 3 0.95,-1.35; 4 0.95,1.35; 5 -0.95,1.35
SOIC127P500X400-8N = smd 1.778 x 0.635: 1 -2.819,1.905; 2 -2.819,0.635; 3 -2.819,-0.635; 4 -2.819,-1.905; 5 2.819,-1.905; 6 2.819,-0.635; 7 2.819,0.635; 8 2.794,1.905
PDS1 = drill 1 octagon: P1 -5.08,0; P2 -2.54,0; P3 0,0; P4 2.54,0
FMC_SINGLE_WIDTH_MODULE = drill 2.7 pad 4: BEZ1 -54.6,59.05; BEZ2 -54.6,2.5
JP2 = drill 0.914 long: 1 0,0; 2 2.54,0

### Placement (x,y rotation side)
C1  28.64,77.8 270 top  (outside the outline)
C2  26.36,78.69 270 top  (outside the outline)
C3  30.93,83.01 90 top  (outside the outline)
C4  57.98,48.72 180 top
C5  17.34,48.72 90 top
C6  33.09,82.5 270 top  (outside the outline)
C7  39.82,76.79 270 top  (outside the outline)
C8  57.98,38.56 0 top
C9  19.88,48.72 90 bottom
C10  19.88,36.02 90 top
C11  41.6,76.79 270 top  (outside the outline)
C12  37.53,77.8 270 top  (outside the outline)
C13  39.18,82.5 90 top  (outside the outline)
C14  45.15,83.77 0 top  (outside the outline)
C15  19.88,36.02 90 bottom
C16  57.98,46.18 180 top
C17  17.34,48.72 270 bottom
C18  27.5,36.02 270 bottom
C19  53.28,83.77 0 top  (outside the outline)
C20  78.05,-10.72 270 top  (outside the outline)
C21  82.11,-11.86 270 top  (outside the outline)
C22  80.33,-11.86 270 top  (outside the outline)
C23  66.87,-9.83 270 top  (outside the outline)
C24  69.16,-10.72 270 top  (outside the outline)
C25  67.76,56.34 90 bottom
C26  74.36,66.25 90 top
C27  67.76,53.16 90 bottom
C28  70.04,66.25 90 top
C29  67.76,59.52 90 bottom
C30  71.95,56.47 270 bottom
C31  71.95,59.52 270 bottom
C32  71.95,53.29 270 bottom
C33  57.98,51.26 0 top
C34  19.88,52.53 270 top
C35  27.5,43.64 90 bottom
C36  19.88,52.53 270 bottom
C37  57.98,53.8 0 top
C38  22.42,43.64 270 bottom
C39  57.98,57.61 180 top
C40  17.34,55.07 270 bottom
C41  17.34,55.07 270 top
C42  57.98,36.02 0 top
C43  57.98,41.1 180 top
C44  19.88,42.37 90 top
C45  17.34,42.37 90 top
C46  17.34,42.37 90 bottom
C47  57.98,43.64 0 top
C48  22.42,36.02 270 bottom
C49  19.88,42.37 90 bottom
C50  57.98,33.48 0 top
C51  17.34,36.02 90 top
C_ISO1  2.1,55.07 90 top
C_ISO2  2.1,48.72 90 top
C_ISO3  2.1,42.37 90 top
C_ISO4  2.1,36.02 90 top
D7  61.28,-10.72 0 top  (outside the outline)
DI_ISO1  27.5,57.61 45 bottom
DI_ISO2  36.39,48.72 315 top
DI_ISO3  36.39,48.72 45 bottom
DI_ISO4  47.82,39.83 90 bottom
DO_ISO1  27.5,57.61 135 top
DO_ISO2  47.82,39.83 90 top
FMC  67.63,34.5 270 bottom
L1  40.71,79.45 180 top  (outside the outline)
L2  81.22,-9.06 180 top  (outside the outline)
POW_SEL  97.22,-14.27 90 top  (outside the outline)
POW_TP  89.73,-8.68 270 top  (outside the outline)
Q1  62.42,-7.03 0 top  (outside the outline)
R1  3.37,56.34 0 bottom
R2  3.37,53.8 0 bottom
R3  3.37,41.1 0 bottom
R4  21.91,83.9 90 top  (outside the outline)
R5  24.58,78.69 270 top  (outside the outline)
R6  25.47,76.03 0 top  (outside the outline)
R7  23.94,83.9 90 top  (outside the outline)
R8  3.37,49.99 0 bottom
R9  3.37,47.45 0 bottom
R10  3.37,43.64 0 bottom
R11  62.3,-12.49 180 top  (outside the outline)
R12  65.09,-9.83 270 top  (outside the outline)
R13  65.98,-12.49 0 top  (outside the outline)
R14  3.37,34.75 0 bottom
R15  3.37,37.29 0 bottom
TP10  22.29,81.87 0 top  (outside the outline)
TP13  45.53,72.98 0 top  (outside the outline)
TP15  35.25,80.34 180 top  (outside the outline)
U1  33.09,77.8 0 top  (outside the outline)
U2  35.88,82.5 90 top  (outside the outline)
U3  10.99,48.72 180 bottom
U4  10.99,48.72 180 top
U5  10.99,42.37 180 bottom
U6  47.95,80.6 180 top  (outside the outline)
U7  73.6,-10.72 0 top  (outside the outline)
U8  65.6,3 0 top
U9  10.99,42.37 180 top
U10  24.96,36.02 0 top
U11  10.99,36.02 180 bottom
U12  10.99,55.07 180 bottom
U13  10.99,55.07 180 top
U14  24.96,43.64 0 top
U15  10.99,36.02 180 top
VDD_AUX  55.57,-7.41 270 top  (outside the outline)

### Tracks (layer width: path | path; a pad name or v marks a point on that pad's centre or on a via)
12V_FPGA  (8 unrouted)
+3V3  (24 unrouted)
  pour $VCC (rank 2): 80.84,80.47 13.78,80.47 13.78,62.21 arc-90 10.96,59.39 -15.68,59.39 -15.68,53.93 45.41,53.93 45.41,45.29 48.2,45.29 48.2,14.94 -15.68,14.94 -15.68,8.08 11.68,8.08 arc-90 13.66,6.1 13.66,-8.43 80.84,-8.43
+3V3_ISO  (via drill 0.3, 0.48)  (42 unrouted)
  Top 0.305: R7.1 25.06,83.03 v25.21,82.88
  Top 0.406: U2.5 34.53,82.07 34.1,82.5 31.06,82.5 | 30.8,81.49 C3.1
  Top 0.61: 31.06,82.5 30.8,82.25 30.8,81.49
  other vias: 29.15,82.88 29.15,81.99 29.15,81.11
  pour $VCC (isolate 0.254): -1.71,16.59 40.33,16.59 40.33,45.29 42.87,45.29 42.87,52.28 -1.71,52.28
  pour Top (no thermals): 28.77,83.26 32.2,83.26 32.2,80.85 28.77,80.85
+3V6  (1 unrouted)
  Top 0.406: U7.1 69.84,-9.75 C24.1
  Top 0.61: C24.1 66.97,-9.06 C23.1 R12.1
+3V6_ISO  (4 unrouted)
  Top 0.254: TP10.TP 22.39,81.74 21.71,82.43
  Top 0.305: R4.1 21.84,82.96 21.58,82.55
  Top 0.406: U1.1 30.85,78.77 30.42,79.2
  Top 0.61: 30.42,79.2 30.17,79.45 C1.1 28.13,79.45 28.03,79.56 C2.1 R5.1 21.71,82.43 21.58,82.55 21.51,82.63
+5V0  (via drill 0.3)
  Top 0.254: U2.1 36.32,81.55 36.14,81.74 36.14,83.26 36.39,83.52 37.17,83.52 U2.3 | U1.8 35.25,78.79 v35.25,79.45 TP15.TP | v35.25,76.03 35.27,76.05 U1.5
  Top 0.406: C11.1 L1.2 | C12.1 36.85,78.77 U1.8 | C13.1 37.32,81.46 U2.1
  Top 0.61: C12.1 L1.2 39.84,80.8 C13.1
  Bottom 0.254: v35.25,79.45 v35.25,76.03
+5V0_ISO-PRE
  Top 0.61: C14.1 45.41,81.87 U6.P4 42.71,80.6 L1.1
AGND1
  Top 0.406: U7.2 67.17,-10.39 C23.2 R12.2 65.09,-12.47 R13.1
AGND2
  Top 0.406: U1.2 28.08,78.13 27.75,77.8 26.38,77.8 C2.2 R5.2 24.58,76.05 R6.1
AUX_VDD  (1 unrouted)
CS  (2 unrouted)
CS+_ISOLATED1  (1 unrouted)
CS+_ISOLATED3  (1 unrouted)
CS-_ISOLATED1  (1 unrouted)
CS-_ISOLATED3  (1 unrouted)
CS_ISO  (3 unrouted)
G24  (via drill 0.3)  (1 unrouted)
  Top 0.254: v42.74,87.58 42.74,88.09 42.64,88.34
  Bottom 0.254: v42.74,87.58 42.99,87.33
GND  (via drill 0.3, 0.48)  (91 unrouted)
  Top 0.61: R11.1 64.3,-13.64 v66.36,-13.64
  other vias: 73.6,-11.35 73.6,-10.08 74.62,-13.64 74.74,-8.68 72.58,-8.68 72.33,-13.64 70.43,-13.64 68.27,-13.64
  pour $GND (rank 2): 80.84,80.47 80.84,-8.43 13.66,-8.43 13.66,6.03 arc90 11.61,8.08 -15.68,8.08 -15.68,14.94 48.2,14.94 48.2,45.29 45.41,45.29 45.41,53.93 -15.68,53.93 -15.68,59.39 13.78,62.24 13.78,80.47
  pour Top (no thermals): 83.63,-13.89 83.63,-10.59 75,-10.59 75,-8.3 72.2,-8.3 72.2,-11.48 65.98,-11.48 65.98,-13.89
GND_ISO  (via drill 0.3, 0.48)  (52 unrouted)
  Top 0.61: C3.2 v32.71,84.66 | C6.2 33.09,79.83 32.96,79.71 | v39.18,84.66 C13.2 38.14,82.5 U2.2 | C14.2 46.8,81.74
  other vias: 33.09,77.17 33.09,78.44 42.74,74.88 42.74,76.53 40.71,74.88 38.55,74.88 36.26,74.88 34.1,74.88 34.23,79.83 32.07,79.83 31.82,74.88 29.91,74.88 27.75,74.88 25.85,74.88
  pour $GND (isolate 0.254): -1.71,16.59 40.33,16.59 40.33,45.29 42.87,45.29 42.87,52.28 -1.71,52.28
  pour Top (no thermals): 43.12,74.63 43.12,77.93 34.48,77.93 34.48,80.22 31.69,80.22 31.69,77.04 25.47,77.04 25.47,74.63
H13  (4 unrouted)
H13_ISO  (3 unrouted)
H14  (4 unrouted)
H14_ISO  (3 unrouted)
H23  (2 unrouted)
H23_ISO  (3 unrouted)
MISO1  (4 unrouted)
MISO1+_ISOLATED1  (2 unrouted)
MISO1+_ISOLATED2  (2 unrouted)
MISO1+_ISOLATED3  (2 unrouted)
MISO1+_ISOLATED4  (2 unrouted)
MISO1-_ISOLATED1  (2 unrouted)
MISO1-_ISOLATED2  (2 unrouted)
MISO1-_ISOLATED3  (2 unrouted)
MISO1-_ISOLATED4  (2 unrouted)
MISO1_ISO  (7 unrouted)
MISO2  (4 unrouted)
MISO2+_ISOLATED1  (2 unrouted)
MISO2+_ISOLATED2  (2 unrouted)
MISO2+_ISOLATED3  (2 unrouted)
MISO2+_ISOLATED4  (2 unrouted)
MISO2-_ISOLATED1  (2 unrouted)
MISO2-_ISOLATED2  (2 unrouted)
MISO2-_ISOLATED3  (2 unrouted)
MISO2-_ISOLATED4  (2 unrouted)
MISO2_ISO  (7 unrouted)
MOSI  (2 unrouted)
MOSI_ISO  (5 unrouted)
N$1  (1 unrouted)
N$2  (1 unrouted)
N$3  (1 unrouted)
  Top 0.61: 63.37,-10.55 D7.C 63.37,-10.42 Q1.S 63.37,-7.99 64.33,-7.03
N$4
  Top 0.406: U1.6 39.82,77.47 C7.1
N$6
  Top 0.61: R11.2 61.26,-12.49 D7.A 59.89,-10.72 Q1.G
N$7
  Top 0.61: Q1.D 55.95,-7.03 VDD_AUX.1
N$9  (1 unrouted)
N$10
  Top 0.305: R7.2 23.08,83.9 21.02,83.9
N$11  (1 unrouted)
N$12  (1 unrouted)
N$13  (1 unrouted)
N$14  (1 unrouted)
N$15  (1 unrouted)
N$16  (1 unrouted)
N$17  (1 unrouted)
N$18  (1 unrouted)
N$19  (1 unrouted)
N$20  (1 unrouted)
N$21  (1 unrouted)
N$22  (1 unrouted)
N$23  (1 unrouted)
N$24  (1 unrouted)
N$97
  Top 0.406: U2.4 34.51,83.47 33.2,83.47 C6.1
SCLK  (2 unrouted)
SCLK_ISO  (5 unrouted)
TDI-TDO  (1 unrouted)
VDD_POST_LC  (via drill 0.3)  (3 unrouted)
  Top 0.254: U7.8 75.76,-9.72 v75.76,-9.06 | v75.76,-12.49 75.78,-12.47 U7.5
  Bottom 0.254: v75.76,-9.06 v75.76,-12.49

### Text on the board
tPlace: C | isolated | +3v3 | +3v6 | GND | VDD_AUX | COMMON | FMC_12P0V | + | -
bPlace: G22 | FMC IO Module / Rev. 0.1 / 2016.03